# Altium project STM32F103C8T6.PrjPcb (part 1 of 2)
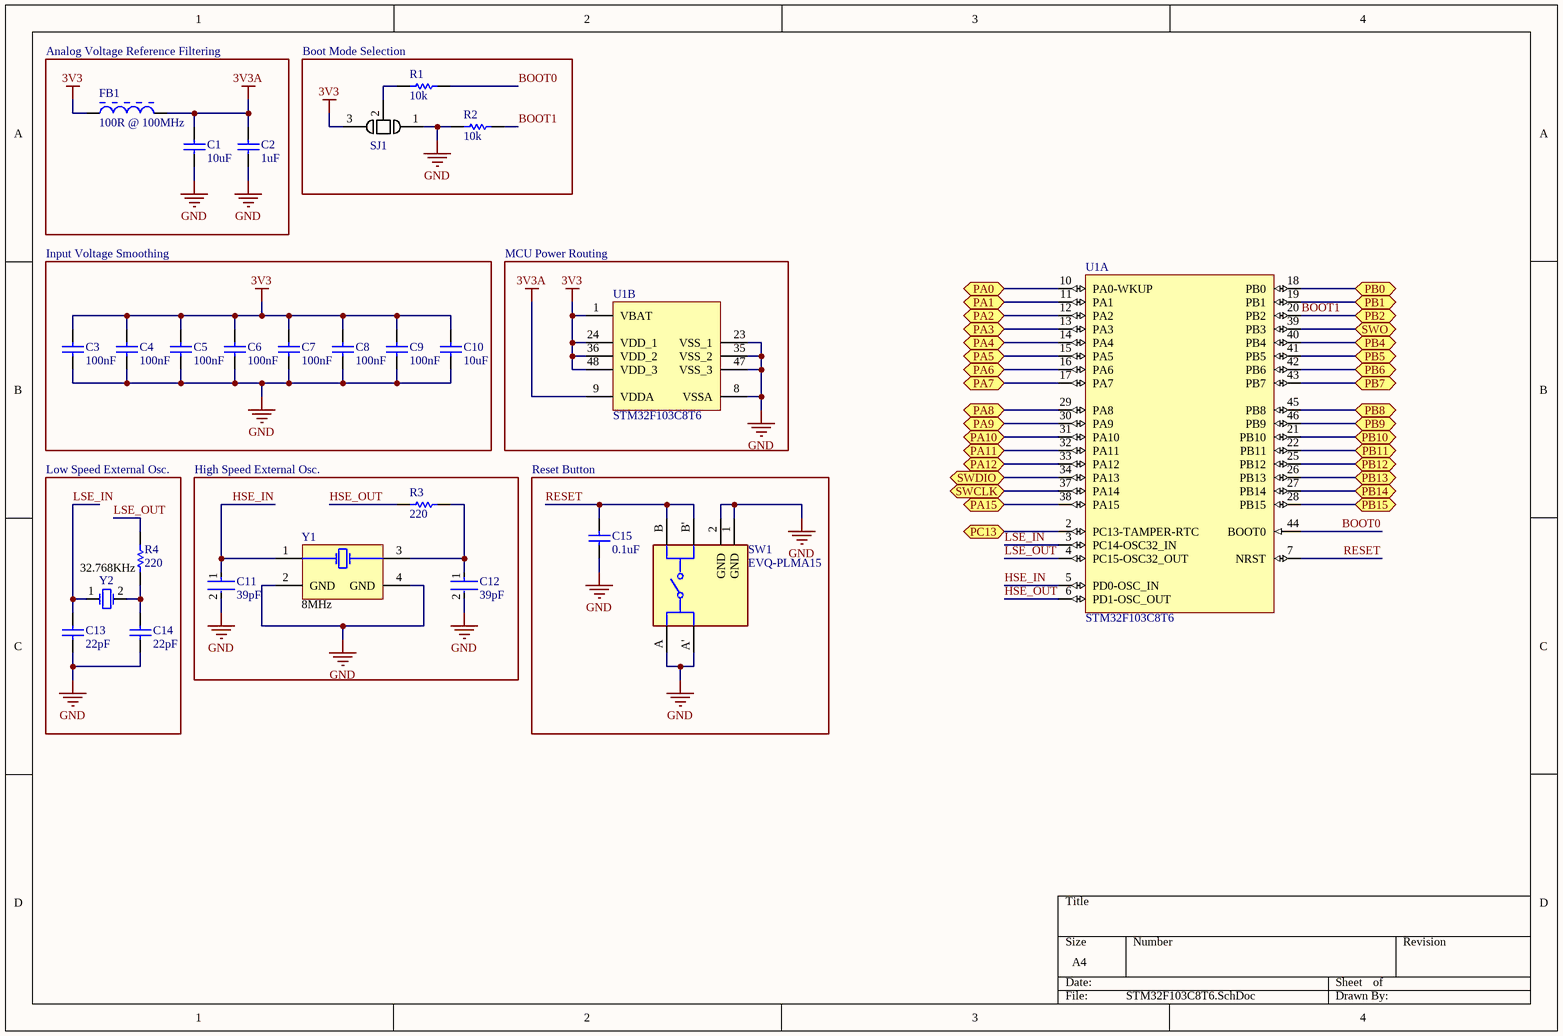
[diagram p0: STM32F103C8T6.SchDoc]
1 sheet, 25 parts. Net scope: flat (ports and power ports of the same name join across sheets).

## Sheet STM32F103C8T6.SchDoc
size A4; SheetNumber: 1; SheetTotal: 1

### Parts
C1  10uF  [CAPC3216X180X50LL20T30]
C2  1uF  [CAPC2013X140X50NL20T25]
C3  100nF  [CAPC2013X94X50LL20T25]
C4  100nF  [CAPC2013X94X50LL20T25]
C5  100nF  [CAPC2013X94X50LL20T25]
C6  100nF  [CAPC2013X94X50LL20T25]
C7  100nF  [CAPC2013X94X50LL20T25]
C8  100nF  [CAPC2013X94X50LL20T25]
C9  100nF  [CAPC2013X94X50LL20T25]
C10  10uF  [CAPC3216X180X50LL20T30]
C11  39pF  [FP-CL21-IPC_B]
C12  39pF  [FP-CL21-IPC_B]
C13  22pF  [CAPC2012X88X50ML20T25]
C14  22pF  [CAPC2012X88X50ML20T25]
C15  0.1uF  [CAPC2013X95X45ML10T25]
FB1  100R @ 100MHz  [MURA-BLM18PG_KG-B25-CHIP-2_V1]
R1  10k  [RESC2013X70X40LL20T20]
R2  10k  [RESC2013X70X40LL20T20]
R3  220  [RESC2013X70X40NL20T20]
R4  220  [RESC2013X70X40NL20T20]
SJ1  Switchable Jumper  [6mil Switchable]  (value not drawn)
SW1  EVQ-PLMA15  [FP-EVQ-PLMA15-MFG]
U1  STM32F103C8T6  [STM-LQFP48_L]  (parts A,B of 2)
Y1  8MHz  [ABRA-ABM3B_V]
Y2  32.768KHz  [CMHT-CM315D-2_V]

### Blocks framed on the sheet
Analog Voltage Reference Filtering: C1 C2 FB1
Boot Mode Selection: R1 R2 SJ1
Input Voltage Smoothing: C3-C10
MCU Power Routing: U1
Low Speed External Osc.: C13 C14 R4 Y2
High Speed External Osc.: C11 C12 R3 Y1
Reset Button: C15 SW1

### Ports
PA0 (bidir), PA1 (bidir), PA2 (bidir), PA3 (bidir), PA4 (bidir), PA5 (bidir), PA6 (bidir), PA7 (bidir), PA8 (bidir), PA9 (bidir), PA10 (bidir), PA11 (bidir), PA12 (bidir), PA15 (bidir), PB0 (bidir), PB1 (bidir), PB2 (bidir), PB4 (bidir), PB5 (bidir), PB6 (bidir), PB7 (bidir), PB8 (bidir), PB9 (bidir), PB10 (bidir), PB11 (bidir), PB12 (bidir), PB13 (bidir), PB14 (bidir), PB15 (bidir), PC13 (bidir), SWCLK (bidir), SWDIO (bidir), SWO (bidir)

### Nets
3V3: C3.2 C4.2 C5.2 C6.2 C7.2 C8.2 C9.2 C10.2 FB1.1 SJ1.3 U1.1(VBAT) U1.24(VDD_1) U1.36(VDD_2) U1.48(VDD_3)
3V3A: C1.2 C2.2 FB1.2 U1.9(VDDA)
GND: C1.1 C2.1 C3.1 C4.1 C5.1 C6.1 C7.1 C8.1 C9.1 C10.1 C11.2 C12.2 C13.1 C14.1 C15.2 R2.1 SJ1.1 SW1.1(GND) SW1.2(GND) SW1.A SW1.A' U1.8(VSSA) U1.23(VSS_1) U1.35(VSS_2) U1.47(VSS_3) Y1.2(GND) Y1.4(GND)
BOOT0: R1.2 U1.44(BOOT0)
BOOT1: R2.2 U1.20(PB2) ; port PB2
HSE_IN: C11.1 U1.5(PD0-OSC_IN) Y1.1(X1)
HSE_OUT: R3.2 U1.6(PD1-OSC_OUT)
LSE_IN: C13.2 U1.3(PC14-OSC32_IN) Y2.1
LSE_OUT: R4.2 U1.4(PC15-OSC32_OUT)
RESET: C15.1 SW1.B SW1.B' U1.7(NRST)
NetC12_1: C12.1 R3.1 Y1.3(X2)
NetC14_2: C14.2 R4.1 Y2.2
NetR1_1: R1.1 SJ1.2
NetU1_2: U1.2(PC13-TAMPER-RTC) ; port PC13
NetU1_10: U1.10(PA0-WKUP) ; port PA0
NetU1_11: U1.11(PA1) ; port PA1
NetU1_12: U1.12(PA2) ; port PA2
NetU1_13: U1.13(PA3) ; port PA3
NetU1_14: U1.14(PA4) ; port PA4
NetU1_15: U1.15(PA5) ; port PA5
NetU1_16: U1.16(PA6) ; port PA6
NetU1_17: U1.17(PA7) ; port PA7
NetU1_18: U1.18(PB0) ; port PB0
NetU1_19: U1.19(PB1) ; port PB1
NetU1_21: U1.21(PB10) ; port PB10
NetU1_22: U1.22(PB11) ; port PB11
NetU1_25: U1.25(PB12) ; port PB12
NetU1_26: U1.26(PB13) ; port PB13
NetU1_27: U1.27(PB14) ; port PB14
NetU1_28: U1.28(PB15) ; port PB15
NetU1_29: U1.29(PA8) ; port PA8
NetU1_30: U1.30(PA9) ; port PA9
NetU1_31: U1.31(PA10) ; port PA10
NetU1_32: U1.32(PA11) ; port PA11
NetU1_33: U1.33(PA12) ; port PA12
NetU1_34: U1.34(PA13) ; port SWDIO
NetU1_37: U1.37(PA14) ; port SWCLK
NetU1_38: U1.38(PA15) ; port PA15
NetU1_39: U1.39(PB3) ; port SWO
NetU1_40: U1.40(PB4) ; port PB4
NetU1_41: U1.41(PB5) ; port PB5
NetU1_42: U1.42(PB6) ; port PB6
NetU1_43: U1.43(PB7) ; port PB7
NetU1_45: U1.45(PB8) ; port PB8
NetU1_46: U1.46(PB9) ; port PB9